# Altium schematic sheet POWER_BOARD.SchDoc: POWER_BOARD
size A4; Date: Not used; ApprovedBy: Not used; CheckedBy: Not used; Author: Not used; CompanyName: STMicroelectronics; DrawnBy: Not used; Engineer: Not used; Organization: Not used; Address1: Not used; Address2: Not used; Address3: Not used; Address4: Not used; DocumentNumber: 6; Revision: Not used; SheetNumber: 6; SheetTotal: 9; CurrentTime: Not used; CurrentDate: Not used; Time: Not used; DocumentFullPathAndName: Not used; DocumentName: Not used; ModifiedDate: Not used; ImagePath: Not used; ProjectName: Not used; Application_BuildNumber: Not used
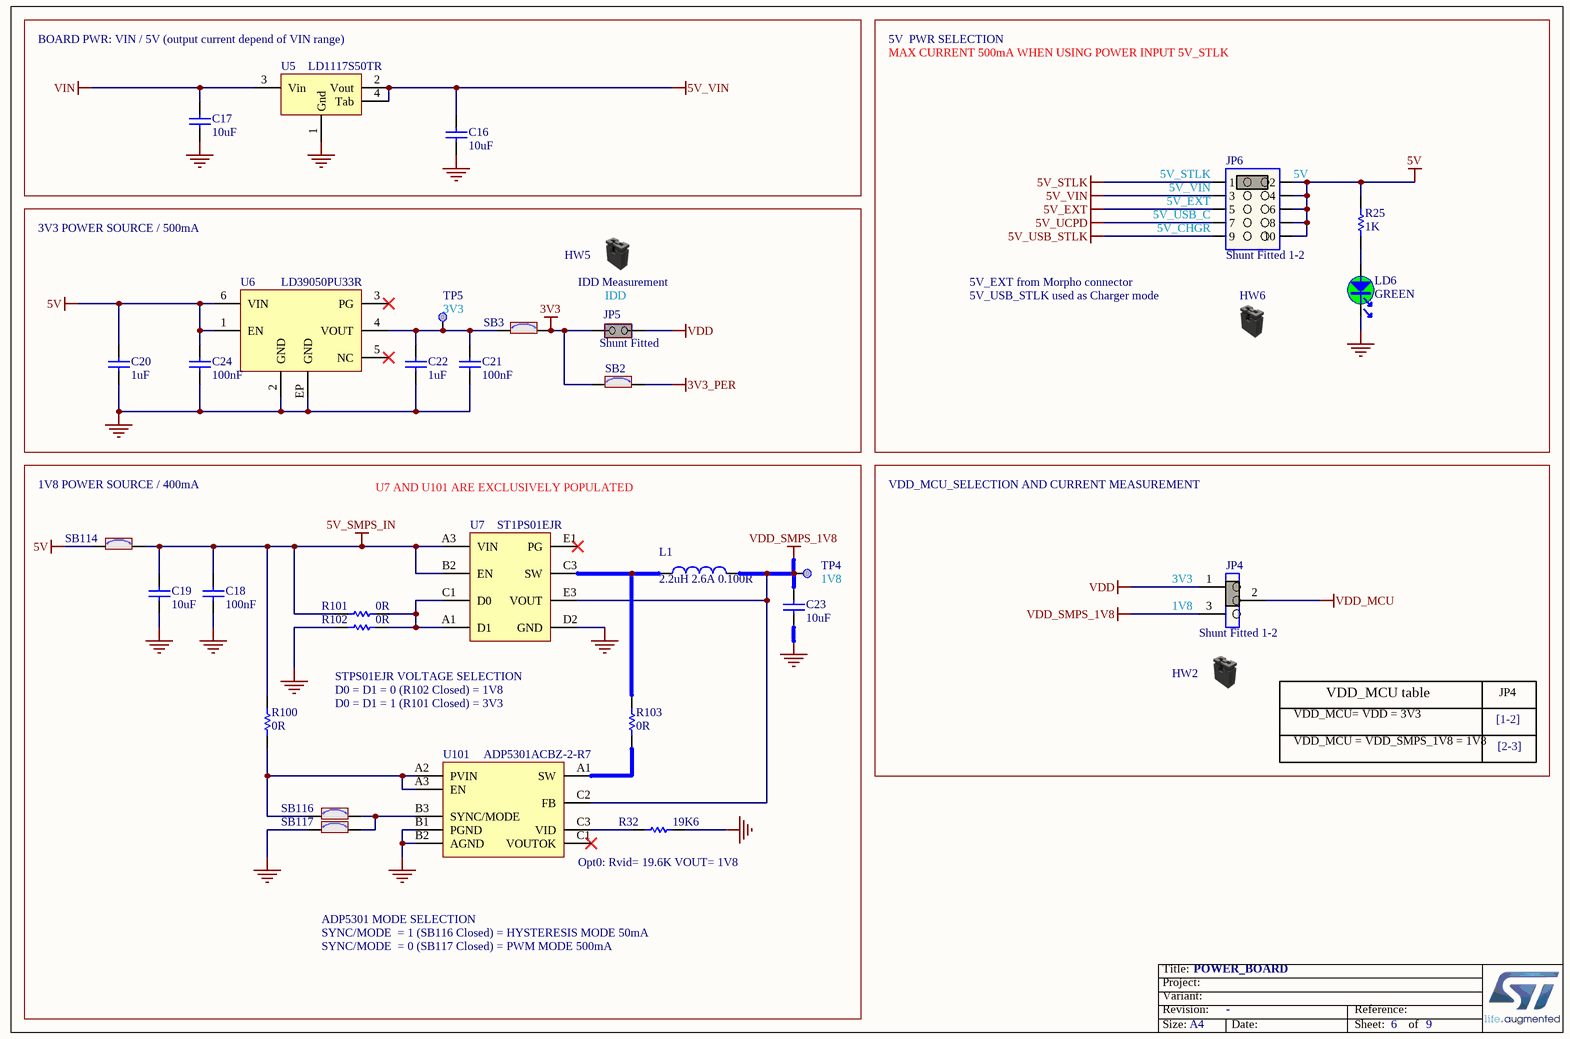
[diagram p0: POWER_BOARD.SchDoc]

## Parts
C16  value 10uF  [C0805]
C17  value 10uF  [C0805]
C18  value 100nF  [C0603]
C19  value 10uF  [C0603]
C20  value 1uF  [C0603]  (hidden comment: Capacitor)
C21  value 100nF  [C0603]
C22  value 1uF  [C0603]  (hidden comment: Capacitor)
C23  value 10uF  [C0603]
C24  value 100nF  [C0603]
HW2  (no value)  (mechanical)
HW5  (no value)  (mechanical)
HW6  (no value)  (mechanical)
JP4  value Shunt Fitted 1-2  [CON_SAMTEC_TSW-103-07-F-S]
JP5  value Shunt Fitted  [CON_SAMTEC_TSW-102-07-G-S]
JP6  value Shunt Fitted 1-2  [CON_SAMTEC_TSW-105-07-X-D]
L1  value 2.2uH 2.6A 0.100R  [IND_TDK_VLS252010HBX-1]
LD6  value GREEN  [LED_0603_GREEN]
R25  value 1K  [R0603]
R32  value 19K6  [R0603]
R100  value 0R  [R0603]
R101  value 0R  [R0603]
R102  value 0R  [R0603]
R103  value 0R  [R0603]
SB2  (no value)  [SOLDER-BRIDGE_R0603-0R]
SB3  (no value)  [SOLDER-BRIDGE_R0603-0R]
SB114  (no value)  [SOLDER-BRIDGE_R0603-0R]
SB116  (no value)  [SOLDER-BRIDGE_R0603-0R]
SB117  (no value)  [SOLDER-BRIDGE_R0603-0R]
TP4  (no value)  [TP_SMD_1MM]  (no BOM)
TP5  (no value)  [TP_SMD_1MM]  (no BOM)
U5  value LD1117S50TR  [REG_SOT223-TAB]
U6  value LD39050PU33R  [ICC_DFN6-EPAD_3X3_P095]
U7  value ST1PS01EJR  [ICC_FLIP-CHIP-BGA8_1P11X1P41_P040]
U101  value ADP5301ACBZ-2-R7  [ICC_WLCSP9_1P65X1P87_P050]

## Blocks framed on the sheet
BOARD PWR: VIN / 5V (output current depend of VIN range): C16 C17 U5
VDD_MCU table: HW2 JP4

## Nets
3V3: JP5.1(COMMON) SB2.1 SB3.2
3V3_PER: SB2.2
5V: C20.2 C24.2 JP6.2 JP6.4 JP6.6 JP6.8 JP6.10 R25.2 SB114.1 U6.1(EN) U6.6(VIN)
5V_EXT: JP6.5
5V_SMPS_IN: C18.2 C19.2 R100.1 R101.2 SB114.2 U7.A3(VIN) U7.B2(EN)
5V_STLK: JP6.1
5V_UCPD: JP6.7
5V_USB_STLK: JP6.9
5V_VIN: C16.2 JP6.3 U5.2(Vout) U5.4(Tab)
GND: C16.1 C17.1 C18.1 C19.1 C20.1 C21.1 C22.1 C23.1 C24.1 LD6.2 R32.2 R102.2 SB117.1 U5.1(Gnd) U6.2(GND) U6.EP(GND) U7.D2(GND) U101.B1(PGND) U101.B2(AGND)
VDD: JP4.1 JP5.2(NO)
VDD_MCU: JP4.2
VDD_SMPS_1V8: C23.2 JP4.3 L1.2 TP4.1 U7.E3(VOUT) U101.C2(FB)
VIN: C17.2 U5.3(Vin)
NetC21_2: C21.2 C22.2 SB3.1 TP5.1 U6.4(VOUT)
NetL1_1: L1.1 R103.1 U7.C3(SW)
NetLD6_1: LD6.1 R25.1
NetR32_1: R32.1 U101.C3(VID)
NetR100_2: R100.2 SB116.1 U101.A2(PVIN) U101.A3(EN)
NetR101_1: R101.1 R102.1 U7.A1(D1) U7.C1(D0)
NetR103_2: R103.2 U101.A1(SW)
NetSB116_2: SB116.2 SB117.2 U101.B3(SYNC/MODE)

Not connected (* = marked no-connect by the designer): U6 3(PG)* 5(NC)*; U7 E1(PG)*; U101 C1(VOUTOK)*

## Notes on the sheet
- 5V  PWR SELECTION
- MAX CURRENT 500mA WHEN USING POWER INPUT 5V_STLK
- (near JP6) 5V_STLK
- (near JP6) 5V
- 3V3 POWER SOURCE / 500mA
- (near JP6) 5V_CHGR
- (near JP6) 5V_VIN
- (near JP6) 5V_EXT
- (near JP6) 5V_USB_C
- (near TP5) 3V3
- IDD Measurement
- (near JP5) IDD
- 5V_EXT from Morpho connector
- 5V_USB_STLK used as Charger mode
- 1V8 POWER SOURCE / 400mA
- U7 AND U101 ARE EXCLUSIVELY POPULATED
- VDD_MCU_SELECTION AND CURRENT MEASUREMENT
- (near TP4) 1V8
- (near JP4) 3V3
- 1V8
- STPS01EJR VOLTAGE SELECTION
  D0 = D1 = 0 (R102 Closed) = 1V8
  D0 = D1 = 1 (R101 Closed) = 3V3
- VDD_MCU= VDD = 3V3
- [1-2]
- JP4
- VDD_MCU = VDD_SMPS_1V8 = 1V8
- [2-3]
- Opt0: Rvid= 19.6K VOUT= 1V8
- ADP5301 MODE SELECTION
  SYNC/MODE  = 1 (SB116 Closed) = HYSTERESIS MODE 50mA
  SYNC/MODE  = 0 (SB117 Closed) = PWM MODE 500mA
- Title:
- Project:
- Size:
- Revision:
- Variant:
- A4
- -
- Date:
- Reference:
- Sheet:
- of

## Library data of the parts
C16 C17 = MCD-00014: Capacitor, MLCC, 10uF, 25V, X5R, 10%, 0805, T=0,85mm; Manufacturer_Part_Number: CC0805KRX5R8BB106; Manufacturer: YAGEO; Provided_By: Subcon; Initial_Board_Reference: MB1274; Internal_Part_Number: MCD-00014; ECCN_US: n/a; ECCN_EU: n/a; ComponentLink1Description: Datasheet; Status: Released; Part_Type: Capacitor; Package: C0805; ComponentLink1URL: http://tunmcdsvn.tun.st.com/Component_Datasheet_Library/Trunk/Capacitors/Yageo_Multilayer_capacitor_X5R_series_100pF_to_100uF
C18 C21 C24 = MCD-00211: Capacitor, MLCC, 100nF, 16V, X7R, 10%, 0603, T=0,8mm; Manufacturer_Part_Number: CC0603KRX7R7BB104; Manufacturer: YAGEO; Provided_By: Subcon; Initial_Board_Reference: MB1319; Internal_Part_Number: MCD-00211; ECCN_US: n/a; ECCN_EU: n/a; ComponentLink1Description: Datasheet; Status: Released; Part_Type: Capacitor; Package: C0603; ComponentLink1URL: http://tunmcdsvn.tun.st.com/Component_Datasheet_Library/Trunk/Capacitors/Yageo_Multilayer_Capacitor_X7R_series_100pF_to_22uF
C19 C23 = MCD-00243: Capacitor, MLCC, 10uF, 6V3, X5R, 10%, 0603, T=0,8mm; Manufacturer_Part_Number: CC0603KRX5R5BB106; Manufacturer: YAGEO; Provided_By: Subcon; Initial_Board_Reference: MB1319; Internal_Part_Number: MCD-00243; ECCN_US: n/a; ECCN_EU: n/a; ComponentLink1Description: Datasheet; Status: Released; Part_Type: Capacitor; Package: C0603; ComponentLink1URL: http://tunmcdsvn.tun.st.com/Component_Datasheet_Library/Trunk/Capacitors/Yageo_Multilayer_capacitor_X5R_series_100pF_to_100uF
C20 C22 = MCD-00010: Capacitor, MLCC, 1uF, 16V, X5R, 10%, 0603, T=0,8mm; Manufacturer_Part_Number: CC0603KRX5R7BB105; Manufacturer: YAGEO; Provided_By: SUBCO; Internal_Part_Number: MCD-00010; Status: Released; Part_Type: Capacitor; Package: C0603; ComponentLink1Description: Datasheet; ComponentLink1URL: http://tunmcdsvn.tun.st.com/Component_Datasheet_Library/Trunk/Capacitors/Yageo_Multilayer_capacitor_X5R_series_100pF_to_100uF
HW2 HW5 HW6 = MCD-00043: SHUNT 2.54mm BLACK; Manufacturer_Part_Number: SNT-100-BK-G; Manufacturer: SAMTEC; Part_Type: Mechanical; Provided_By: Subcon; Initial_Board_Reference: MB1274; Internal_Part_Number: MCD-00043; ECCN_US: n/a; ECCN_EU: n/a; ComponentLink1Description: Datasheet; Status: Released; ComponentLink1URL: http://tunmcdsvn.tun.st.com/Component_Datasheet_Library/Trunk/Connectors/Samtec_Shunt_Jumper_SNT100
JP4 = MCD-00684: Header, 3x1, 2,54mm, VR, TH, Height 5.84mm/2.54mm - Shunt Fitted 1-2 by default; Part_Type: Connector; Manufacturer_Part_Number: TSW-103-07-F-S; Manufacturer: SAMTEC; Provided_By: Subcon; Initial_Board_Reference: MB1331; Internal_Part_Number: MCD-00684; Status: Released; ComponentLink1Description: Datasheet; ComponentLink1URL: http://tunmcdsvn.tun.st.com/Component_Datasheet_Library/Trunk/Connectors/Samtec_TSW-HTSW-series; ECCN_US: n/a; ECCN_EU: n/a; Remark: Shunt Fitted 1-2
JP5 = MCD-00683: Header, 2x1, 2,54mm, VR, TH, Height 5.84mm/2.54mm - Shunt Fitted by default; Part_Type: Connector; Manufacturer_Part_Number: TSW-102-07-x-S; Manufacturer: SAMTEC; Provided_By: Subcon; Initial_Board_Reference: MB1331; Internal_Part_Number: MCD-00683; Status: Released; ComponentLink1Description: Datasheet; ComponentLink1URL: http://tunmcdsvn.tun.st.com/Component_Datasheet_Library/Trunk/Connectors/Samtec_TSW-HTSW-series; ECCN_US: n/a; ECCN_EU: n/a; Remark: Shunt Fitted
JP6 = MCD-01203: Header, 5x2, 2,54mm, VR, TH, Height 5.84mm/2.54mm - Shunt Fitted 1-2; Part_Type: Connector; Manufacturer_Part_Number: TSW-105-07-x-D; Manufacturer: SAMTEC; Provided_By: Subcon; Initial_Board_Reference: Mb1372; Internal_Part_Number: MCD-01203; Status: Checked; ComponentLink1Description: Datasheet; ComponentLink1URL: http://tunmcdsvn.tun.st.com/Component_Datasheet_Library/Trunk/Connectors/Samtec_TSW-HTSW-series; ECCN_US: n/a; ECCN_EU: n/a
L1 = MCD-00240: FIXED IND 2.2UH 2.6A 100 mOHM 20% SMD; Manufacturer_Part_Number: VLS252010HBX-2R2M-1; Manufacturer: TDK; Provided_By: Subcon; Initial_Board_Reference: MB1319; Internal_Part_Number: MCD-00240; ECCN_US: n/a; ECCN_EU: n/a; ComponentLink1Description: Datasheet; Status: Released; Part_Type: Inductor; ComponentLink1URL: http://tunmcdsvn.tun.st.com/Component_Datasheet_Library/Trunk/Inductors/TDK_Inductor_VLS252010HBX-1
LD6 = MCD-00050: LED, Green, 0603; Manufacturer_Part_Number: 19-213SYGC/S530-E2/TR8; Manufacturer: EVERLIGHT; Part_Type: Display; ECCN_US: EAR99; ECCN_EU: NEC; Provided_By: Subcon; Initial_Board_Reference: MB1274; Internal_Part_Number: MCD-00050; ComponentLink1Description: Datasheet; Status: Released; Package: LED 0603; ComponentLink1URL: http://tunmcdsvn.tun.st.com/Component_Datasheet_Library/Trunk/Display/Everlight_SMD-LED-GREEN_19-213SYGC-S530-XX-TR8-v3.doc
R25 = MCD-00070: Resistor,1K,0603,1%,1/10W; Manufacturer_Part_Number: RC0603FR-071KL; Manufacturer: YAGEO; Provided_By: Subcon; Initial_Board_Reference: MB1274; Internal_Part_Number: MCD-00070; Status: Released; Part_Type: Resistor; Package: R0603; ComponentLink1Description: Datasheet; ComponentLink1URL: http://tunmcdsvn.tun.st.com/Component_Datasheet_Library/Trunk/Resistors/Yageo_Resistor_RC0603-series; ECCN_US: n/a; ECCN_EU: n/a
R32 = MCD-00242: Resistor,19K6,0603,1%,1/10W; Manufacturer_Part_Number: RC0603FR-0719K6L; Manufacturer: YAGEO; Provided_By: Subcon; Initial_Board_Reference: MB1319; Internal_Part_Number: MCD-00242; ECCN_US: n/a; ECCN_EU: n/a; ComponentLink1Description: Datasheet; Status: Released; Part_Type: Resistor; Package: R0603; ComponentLink1URL: http://tunmcdsvn.tun.st.com/Component_Datasheet_Library/Trunk/Resistors/Yageo_Resistor_RC0603-series
R100-R103 = MCD-00056: Resistor,0R,0603,5%,1/10W; Manufacturer_Part_Number: RC0603JR-070RL; Manufacturer: YAGEO; Provided_By: subcon; Initial_Board_Reference: MB1274; Internal_Part_Number: MCD-00056; ECCN_US: n/a; ECCN_EU: n/a; ComponentLink1Description: Datasheet; Status: Released; Part_Type: Resistor; Package: R0603; ComponentLink1URL: http://tunmcdsvn.tun.st.com/Component_Datasheet_Library/Trunk/Resistors/Yageo_Resistor_RC0603-series
SB2 SB3 SB114 SB116 SB117 = MCD-00071: Solder Bridge ON; Part_Type: Mechanical; Provided_By: Subcon; Initial_Board_Reference: MB1274; Internal_Part_Number: MCD-00071; ECCN_US: n/a; ECCN_EU: n/a; Status: Released; ComponentLink1Description: Datasheet
TP4 TP5 = MCD-00074: Test Point 1mm; Part_Type: Mechanical; Initial_Board_Reference: MB1274; Internal_Part_Number: MCD-00074; Value: 1mm; Status: Released; Manufacturer_Part_Number: n/a; Manufacturer: n/a; ComponentLink1Description: Datasheet; ComponentLink1URL: http://na; ECCN_US: n/a; ECCN_EU: n/a; Provided_By: n/a
U5 = MCD-00088: IC REG LDO 5V 0.8A SOT223; Manufacturer: STMICROELECTRONICS; ECCN_US: EAR99; ECCN_EU: NEC; Provided_By: Subcon; Initial_Board_Reference: MB1274; Internal_Part_Number: MCD-00088; Manufacturer_Part_Number: LD1117S50TR; ComponentLink1Description: Datasheet; Status: Released; Part_Type: IC; ComponentLink1URL: http://tunmcdsvn.tun.st.com/Component_Datasheet_Library/Trunk/IC/STM_LDO_LD1117; Package: SOT-223
U6 = MCD-00215: Low quiescent current and low noise voltage regulators; Manufacturer: STMICROELECTRONICS; Part_Type: IC; ECCN_US: EAR99; ECCN_EU: NEC; Provided_By: Subcon; Initial_Board_Reference: MB1319; Internal_Part_Number: MCD-00215; Manufacturer_Part_Number: LD39050PU33R; Status: Released; ComponentLink1Description: Datasheet; ComponentLink1URL: http://tunmcdsvn.tun.st.com/Component_Datasheet_Library/Trunk/IC/STM_LDO_LD39050PU; Package: DFN6 3x3mm
U7 = MCD-00228: 400mA Nano-Quiescent Step down converter; Manufacturer: STMICROELECTRONICS; Part_Type: IC; ECCN_US: EAR99; ECCN_EU: NEC; Provided_By: Subcon; Initial_Board_Reference: MB1319; Internal_Part_Number: MCD-00228; Manufacturer_Part_Number: ST1PS01EJR; ComponentLink1Description: Datasheet; Status: Checked; ComponentLink1URL: http://tunmcdsvn.tun.st.com/Component_Datasheet_Library/Trunk/IC/STM_SMPS_ST1PS01_rel1.31
U101 = MCD-00226: UL Step down regulator: Opt0; Manufacturer: ANALOG DEVICES; Part_Type: IC; ECCN_US: EAR99; ECCN_EU: NEC; Provided_By: Subcon; Initial_Board_Reference: MB1319; Internal_Part_Number: MCD-00226; Manufacturer_Part_Number: ADP5301ACBZ-2-R7; ComponentLink1Description: Datasheet; Status: Released; ComponentLink1URL: http://tunmcdsvn.tun.st.com/Component_Datasheet_Library/Trunk/IC/AD_SMPS_ADP5301